# Altium schematic sheet 36.SchDoc
size 513 x 386 mm
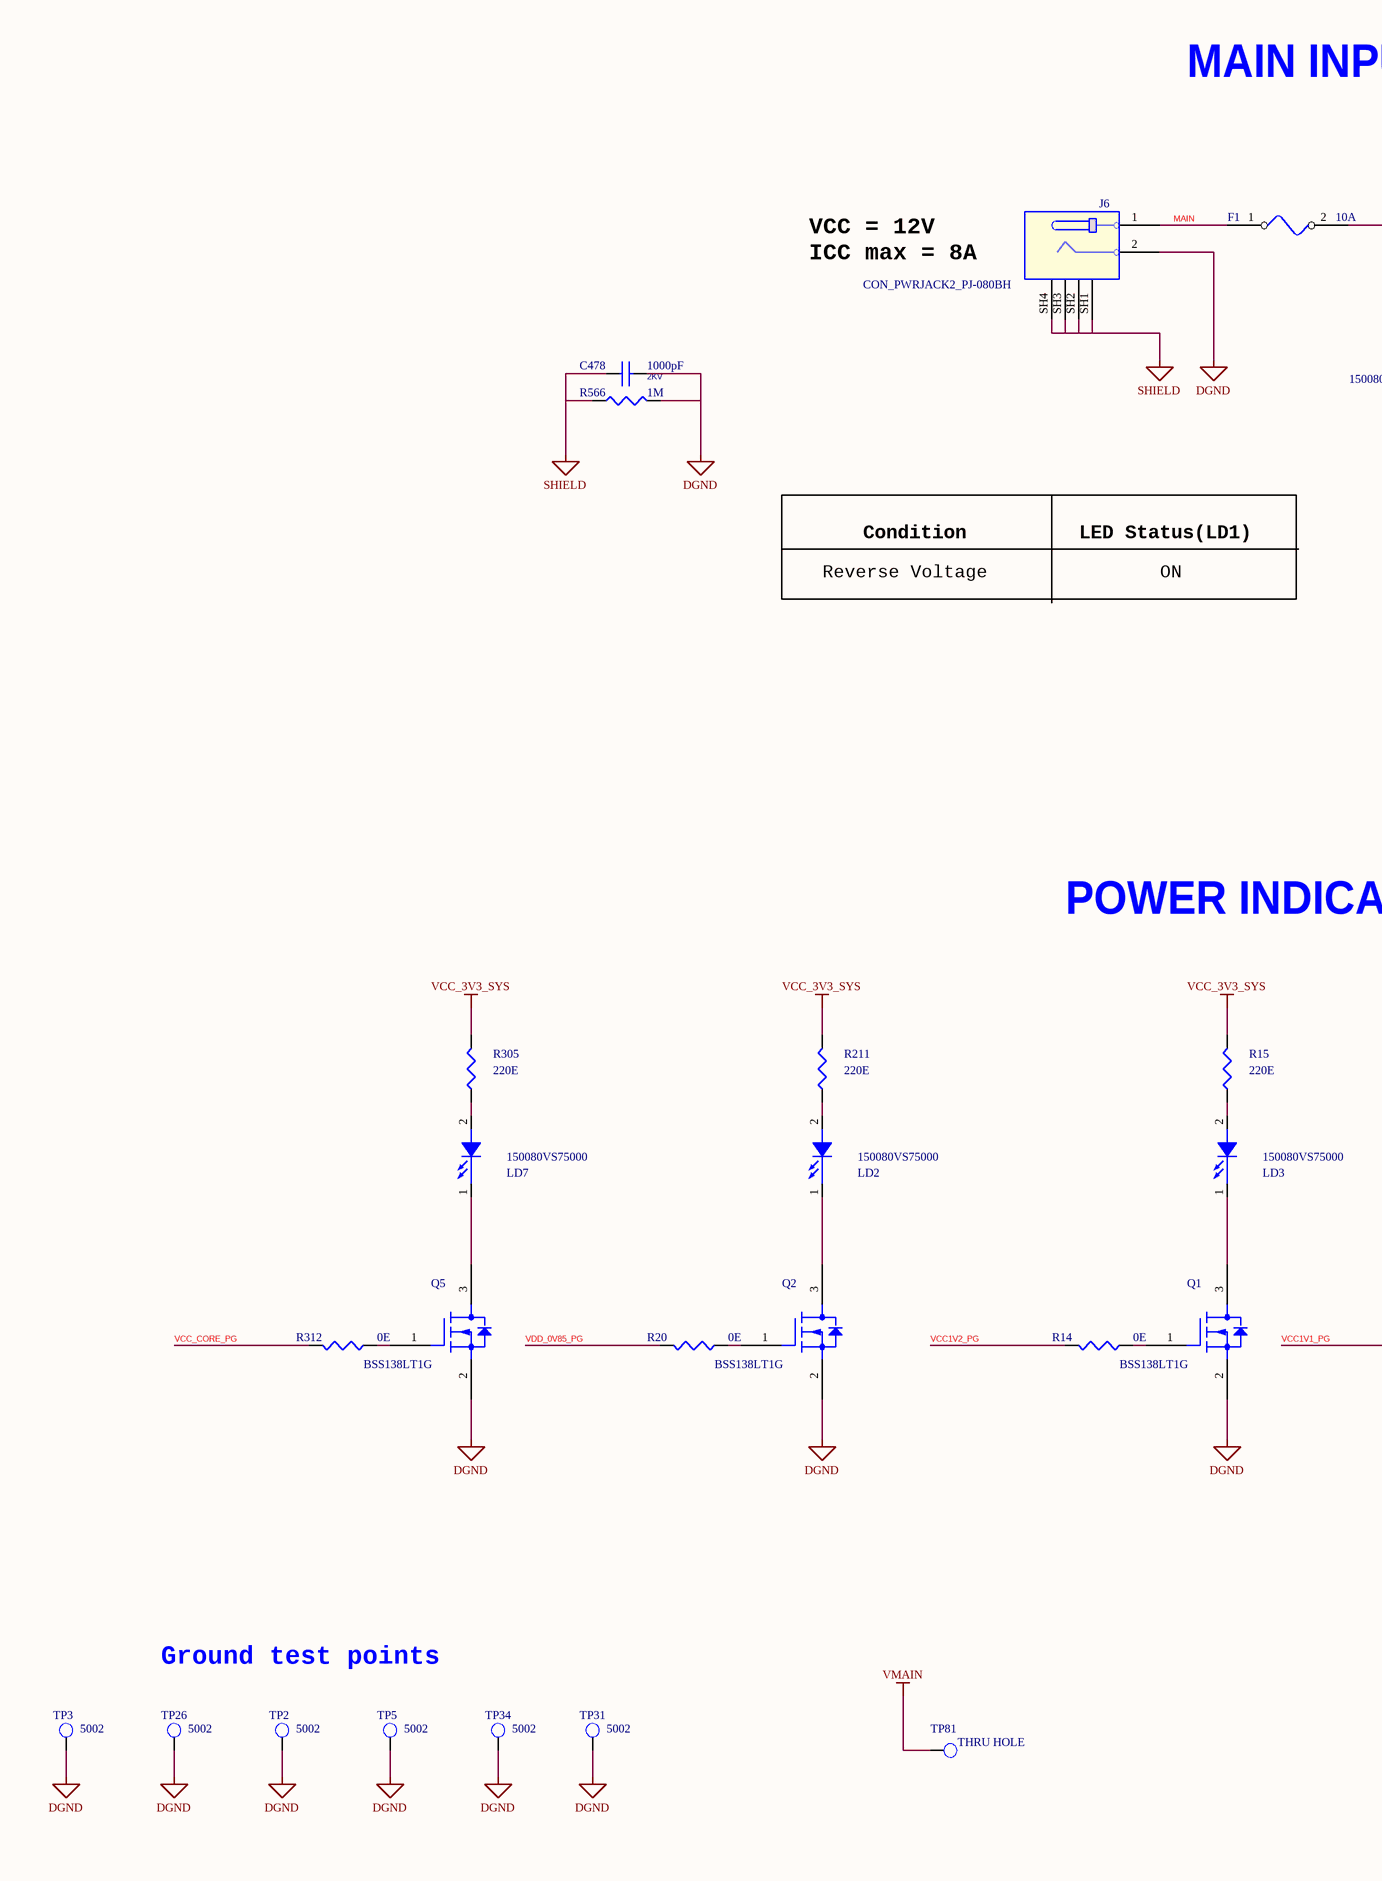
[diagram p0: 36.SchDoc, left]
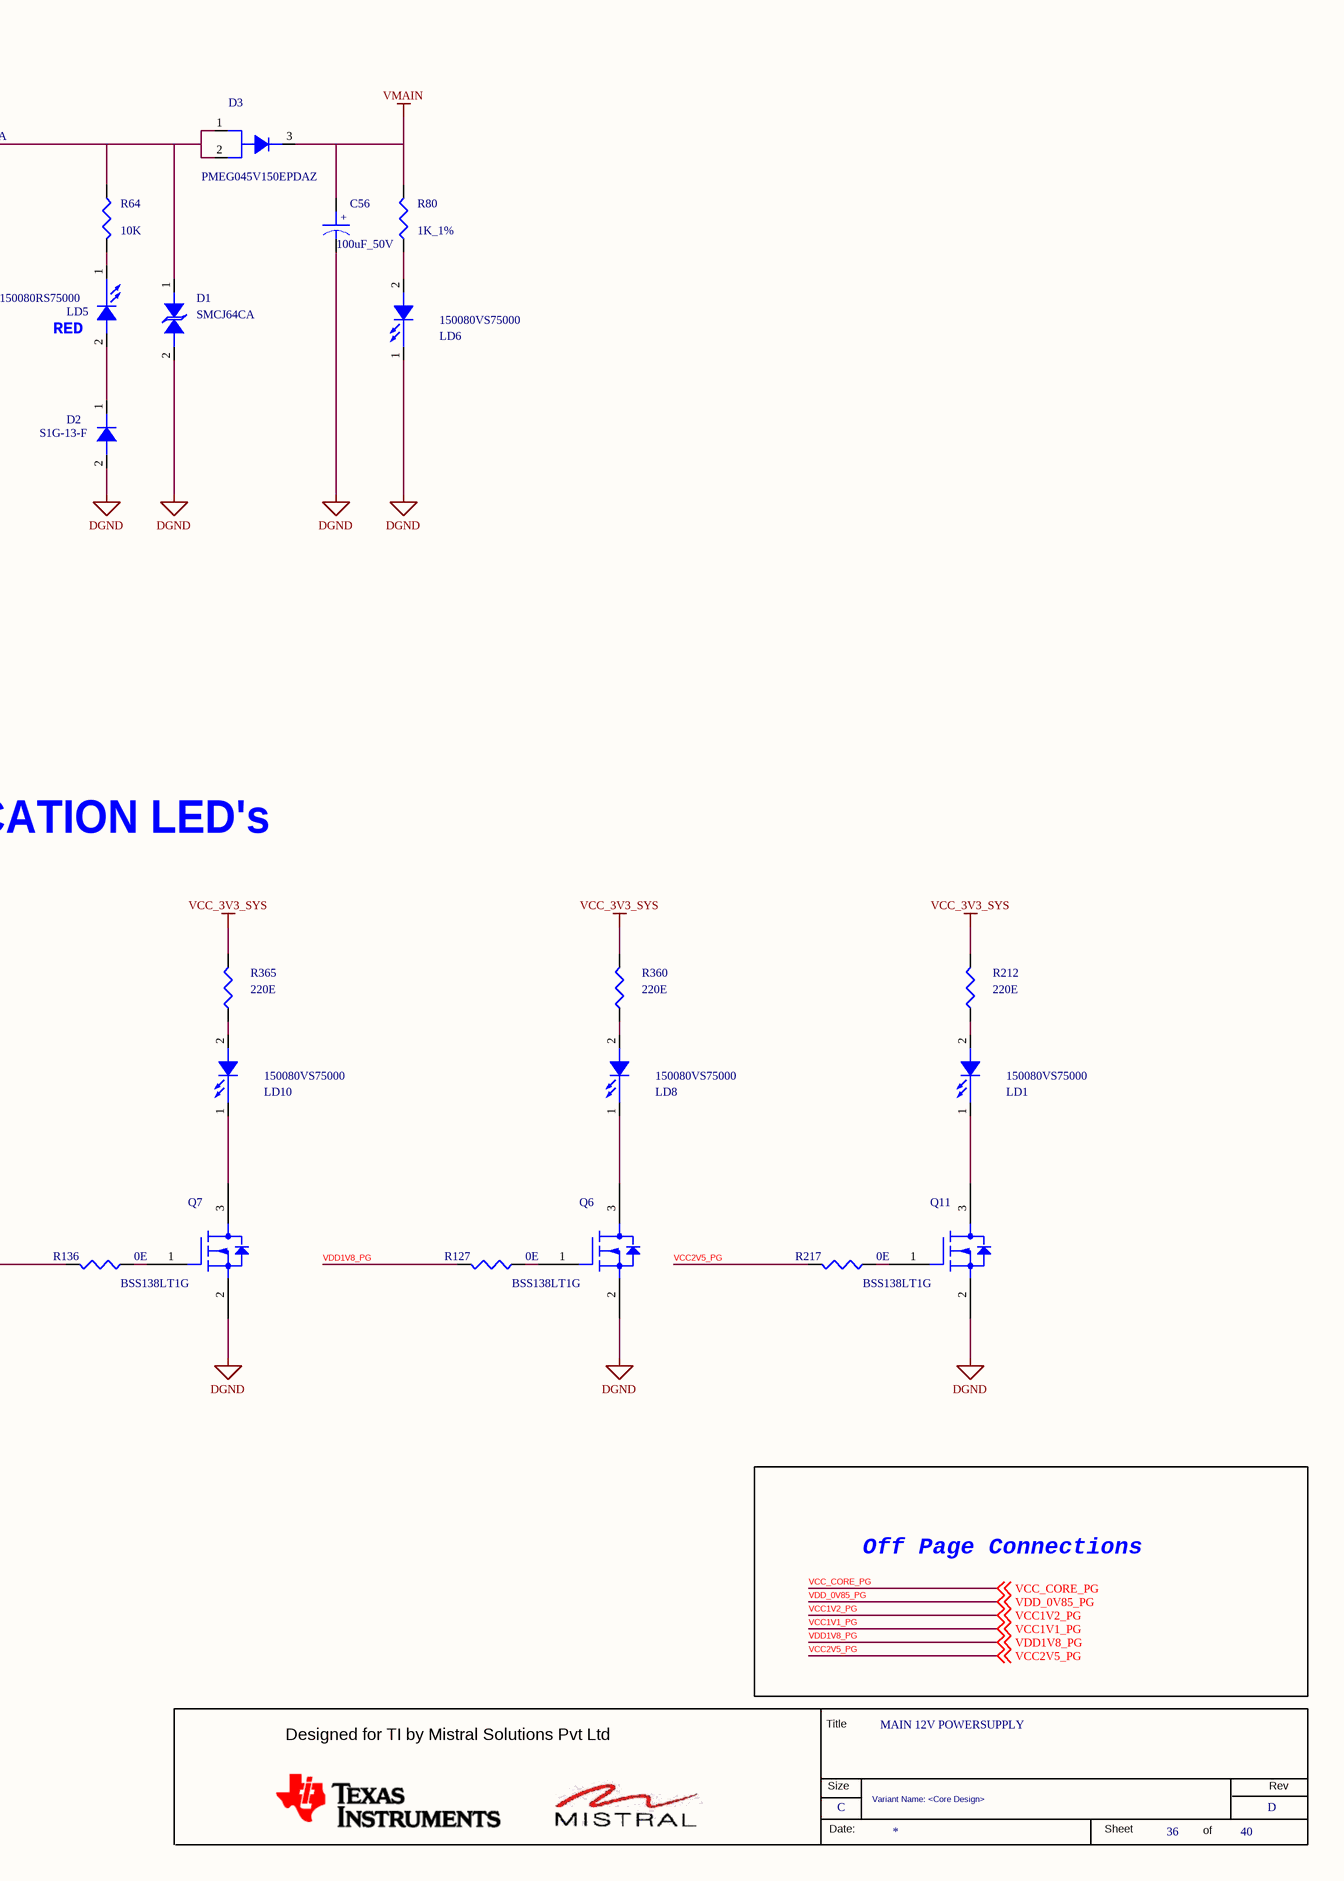
[diagram p1: 36.SchDoc, right]

## Parts
*  RevCode: D  Title: MAIN 12V POWERSUPPLY  Page Size: C  Page Number: 36  Page Count: 40  Variant Name: <Core Design>  (hidden comment: MISTRAL_TITLEBLK_CSIZE)  (graphical)
C56  100uF_50V  [CAPAE_D8CASE_8]
C478  1000pF  Voltage: 2KV  [CAP1206_1-75]
D1  SMCJ64CA  [DIO_SMC]
D2  S1G-13-F  [DIO_SMA]
D3  PMEG045V150EPDAZ  [CFP15_PMEG045V150EPD_0-9]
F1  10A  [FUSE_397_410X110_SMD_2-9]
J6  CON_PWRJACK2_PJ-080BH  [CON_PWRJACK2_PJ-080BH_P_R_T_13-4]
LD1  150080VS75000  [LED_150080VS75000_80X50_SMD_0-8]
LD2  150080VS75000  [LED_150080VS75000_80X50_SMD_0-8]
LD3  150080VS75000  [LED_150080VS75000_80X50_SMD_0-8]
LD5  150080RS75000  [LED_150080VS75000_80X50_SMD_0-8]
LD6  150080VS75000  [LED_150080VS75000_80X50_SMD_0-8]
LD7  150080VS75000  [LED_150080VS75000_80X50_SMD_0-8]
LD8  150080VS75000  [LED_150080VS75000_80X50_SMD_0-8]
LD10  150080VS75000  [LED_150080VS75000_80X50_SMD_0-8]
Q1  BSS138LT1G  [SOT23-123_1-2]
Q2  BSS138LT1G  [SOT23-123_1-2]
Q5  BSS138LT1G  [SOT23-123_1-2]
Q6  BSS138LT1G  [SOT23-123_1-2]
Q7  BSS138LT1G  [SOT23-123_1-2]
Q11  BSS138LT1G  [SOT23-123_1-2]
R14  0E  [RES0402_0-5]
R15  220E  [RES0402_0-5]
R20  0E  [RES0402_0-5]
R64  10K  [RES1206_0-75]
R80  1K_1%  [RES0402_0-5]
R127  0E  [RES0402_0-5]
R136  0E  [RES0402_0-5]
R211  220E  [RES0402_0-5]
R212  220E  [RES0402_0-5]
R217  0E  [RES0402_0-5]
R305  220E  [RES0402_0-5]
R312  0E  [RES0402_0-5]
R360  220E  [RES0402_0-5]
R365  220E  [RES0402_0-5]
R566  1M  [RES0603_0-75]
TP2  5002  [TP_CIR67D40_TH_4-6]
TP3  5002  [TP_CIR67D40_TH_4-6]
TP5  5002  [TP_CIR67D40_TH_4-6]
TP26  5002  [TP_CIR67D40_TH_4-6]
TP31  5002  [TP_CIR67D40_TH_4-6]
TP34  5002  [TP_CIR67D40_TH_4-6]
TP81  THRU HOLE  [TP_40X65]

## Nets
DGND: C56.2 C478.2 D1.2(ANODE) D2.2(A) J6.2 LD6.1(CATHODE) Q1.2(S) Q2.2(S) Q5.2(S) Q6.2(S) Q7.2(S) Q11.2(S) R566.2 TP2.1(TP) TP3.1(TP) TP5.1(TP) TP26.1(TP) TP31.1(TP) TP34.1(TP)
SHIELD: C478.1 J6.SH1 J6.SH2 J6.SH3 J6.SH4 R566.1
VCC_3V3_SYS: R15.2 R211.2 R212.2 R305.2 R360.2 R365.2
VMAIN: C56.1 D3.3(K) R80.2 TP81.1(TP)
MAIN: F1.1 J6.1
VCC1V1_PG: R136.2 ; off-sheet VCC1V1_PG
VCC1V2_PG: R14.2 ; off-sheet VCC1V2_PG
VCC2V5_PG: R217.2 ; off-sheet VCC2V5_PG
VCC_CORE_PG: R312.2 ; off-sheet VCC_CORE_PG
VDD1V8_PG: R127.2 ; off-sheet VDD1V8_PG
VDD_0V85_PG: R20.2 ; off-sheet VDD_0V85_PG
NetD1_1: D1.1(CATHODE) D3.1(A1) D3.2(A2) F1.2 R64.1
NetD2_1: D2.1(K) LD5.2(ANODE)
NetLD1_1: LD1.1(CATHODE) Q11.3(D)
NetLD1_2: LD1.2(ANODE) R212.1
NetLD2_1: LD2.1(CATHODE) Q2.3(D)
NetLD2_2: LD2.2(ANODE) R211.1
NetLD3_1: LD3.1(CATHODE) Q1.3(D)
NetLD3_2: LD3.2(ANODE) R15.1
NetLD5_1: LD5.1(CATHODE) R64.2
NetLD6_2: LD6.2(ANODE) R80.1
NetLD7_1: LD7.1(CATHODE) Q5.3(D)
NetLD7_2: LD7.2(ANODE) R305.1
NetLD8_1: LD8.1(CATHODE) Q6.3(D)
NetLD8_2: LD8.2(ANODE) R360.1
NetLD10_1: LD10.1(CATHODE) Q7.3(D)
NetLD10_2: LD10.2(ANODE) R365.1
NetQ1_1: Q1.1(G) R14.1
NetQ2_1: Q2.1(G) R20.1
NetQ5_1: Q5.1(G) R312.1
NetQ6_1: Q6.1(G) R127.1
NetQ7_1: Q7.1(G) R136.1
NetQ11_1: Q11.1(G) R217.1

## Notes on the sheet
- MAIN INPUT 12V DC
- VCC = 12V
  ICC max = 8A
- (near LD5) RED
- Condition
- LED Status(LD1)
- Reverse Voltage
- ON
- POWER INDICATION LED's
- Ground test points
- Off Page Connections
- (in symbol CAP_POL_Dup1) +
- (in symbol MISTRAL_TITLEBLK_CSIZE) Title; Designed for TI by Mistral Solutions Pvt Ltd; Size; Rev; Date:; Sheet; of

## Library data of the parts
* = MISTRAL_TITLEBLK_CSIZE: Issue: 1.0; Page Create Date: March  8, 1995; Page Modify Date: *
C56 = CAP_POL_Dup1: CAP ELECTROLYTIC 100uF 50V 20% D8CASE_6666; Part_type: CAPACITORS\ELECTROLYTIC; Mfr_part_number: EEE-FTH101XAP; Mfr_name: PANASONIC-ECG; Mistral Part No: 120018100013-R; Custom_Duty: 15%; Customs_HS_Code: 85322990; Wattage: NA; Project: TI_J7_SVB-DUT; Footprint Path: Y:\MIS_DATABASE\Library\ALTIUM_TOOL\PCB_FOOTPRINTS\Altium_Footprint_Lib.PcbLib; Library Path: Y:\MIS_DATABASE\Library\ALTIUM_TOOL\SCHEMATICS_PARTS\MS_DISCRETE_Library.schlib; MECHANICAL 3D STEP FILE: CAPAE_D8CASE_8; Chkd/date: MANIRAJA/051018; Crtd /date: ALVY/051018; Datasheet: Y:\MIS_DATABASE\DATASHEETS\CAPACITORS\FTV-SER.PDF; Temperature: -55癈+105癈; Weight: 440mg; Height: 8.00MM; Footprint Ref: CAPAE_D8CASE_8; Library Ref: CAP_POL; Distributor_part_number: PCE5024CT-ND; Distributor_name: DIGIKEY; Package: D8CASE_6666; Voltage: 50V; Tolerance: 20%; PCB Footprint: CAPAE_D8CASE_8
C478 = CAP_Dup3: CAP CERAMIC 1000pF 2KV 10% X7R 1206; Mistral Part No: 120015080006-R; Mfr_name: AVX CORPORATION; Mfr_part_number: 1206GC102KAT1A; Part_type: CAPACITORS\CERAMIC; Project: ADR1B; Customs_HS_Code: 85322990; Custom_Duty: 15%; Wattage: NA; Tolerance: 10%; Package: 1206; Distributor_name: DIGIKEY; Distributor_part_number: 478-2956-1-ND; Height: 1.52MM; Weight: 16.2mg; Temperature: -55癈+125癈; Datasheet: Y:\MIS_DATABASE\DATASHEETS\CAPACITORS\AVX_HV-MLC.PDF; Crtd /date: MAZHAR/281106; Chkd/date: SHREESHAIL/291106; Library Ref: CAP; Footprint Ref: CAP1206_1-75; Library Path: Y:\MIS_DATABASE\Library\ALTIUM_TOOL\SCHEMATICS_PARTS\MS_DISCRETE_Library.schlib; Footprint Path: Y:\MIS_DATABASE\Library\ALTIUM_TOOL\PCB_FOOTPRINTS\Altium_Footprint_Lib.PcbLib; MECHANICAL 3D STEP FILE: CAP1206_1-75; PCB Footprint: CAP1206_1-75
D1 = DIODE_TVS_DUAL: DIODE TVS BI-DIE 1500W 64V SMC; Mistral Part No: 130015100009-R; Mfr_name: LITTLE FUSE; Part_type: DIODE\TVS; Project: GALILEO_EVM; Tolerance: NA; Customs_HS_Code: 85412900; Custom_Duty: 15%; Library Ref: DIODE_TVS_DUAL; Mfr_part_number: SMCJ64CA; Voltage: 64V; Wattage: NA; Package: SMC; Distributor_name: DIGIKEY; Distributor_part_number: SMCJ64CALFCT-ND; Height: 2.62MM; Weight: NA; Temperature: -55癈+150癈; Datasheet: Y:\MIS_DATABASE\DATASHEETS\DISCRETES\DIODES\LTFUSE-SMCJ.PDF; Crtd /date: VASANTHA/101015; Chkd/date: VASANTHA/101015; PCB Footprint: DIO_SMC
D2 = DIODE: DIODE RECTIFIER 400V 1A SMA; Mistral Part No: 130009030153; Mfr_name: DIODES INC; Part_type: DIODE\RECTIFIER; Project: CPB; Customs_HS_Code: 85412900; Custom_Duty: 15%; PCB Footprint: DIO_SMA; Library Ref: DIODE; Mfr_part_number: S1G-13-F; Voltage: 400V; Package: SMA; Distributor_name: DIGIKEY; Distributor_part_number: S1G-FDICT-ND; Height: 2.30MM; Weight: 0.0064g; Temperature: -65癈+150癈; Datasheet: Y:\MIS_DATABASE\DATASHEETS\DISCRETES\DIODES\S1.PDF; Crtd /date: USMAN/220808; Chkd/date: SUHAS/061010
D3 = DIODE_SCHOTTKY_POWERMITE-3: DIODE SCHOTTKY RECTIFIER 45V 15A CFP15 (SOT1289); Part_type: DIODE\SCHOTTKY; Mfr_name: NEXPERIA; Mistral Part No: 130020020003-R; Custom_Duty: 15%; Customs_HS_Code: 85412900; Wattage: NA; Project: TI_MAXIE_CPB; Footprint Path: Y:\MIS_DATABASE\Library\ALTIUM_TOOL\PCB_FOOTPRINTS\Altium_Footprint_Lib.PcbLib; Library Path: Y:\MIS_DATABASE\Library\ALTIUM_TOOL\SCHEMATICS_PARTS\MS_DISCRETE_Library.schlib; MECHANICAL 3D STEP FILE: CFP15_PMEG045V150EPD_0-9; Chkd/date: MANIRAJA/070220; Crtd /date: ALVY/070220; Datasheet: Y:\MIS_DATABASE\DATASHEETS\DISCRETES\DIODES\PMEG045V150EPD.PDF; Temperature: -55癈+175癈; Weight: 87.3mg; Height: 0.82MM; Library Ref: DIODE_SCHOTTKY_POWERMITE-3; Distributor_part_number: 1727-1905-1-ND; Distributor_name: DIGIKEY; Package: CFP15; Voltage: NA; Tolerance: NA; Mfr_part_number: PMEG045V150EPDAZ; Footprint Ref: CFP15_PMEG045V150EPD_0-9; PCB Footprint: CFP15_PMEG045V150EPD_0-9
F1 = FUSE: FUSE 10A 60V FAST SMD; Mistral Part No: 130009030821-R; Mfr_name: COOPER BUSSMANN; Mfr_part_number: 1025FA10-R; Project: SMART VIEW_NVR; PCB Footprint: FUSE_397_410X110_SMD_2-9; Library Ref: FUSE; Part_type: FUSE; Voltage: 60V; Package: SMD; Distributor_name: DIGIKEY; Distributor_part_number: TR2/1025FA10-R-ND; Height: 2.90MM; Datasheet: Y:\MIS_DATABASE\DATASHEETS\MISC\FUSE\1025FA-SER.PDF; Crtd /date: MAZHAR/220907; Chkd/date: RAGESH/151010
J6 = CON_PWRJACK2_PJ-082BH: CON POWER JACK 2POS MALE RT TH; Mistral Part No: 150021020035-R; Mfr_name: CUI INC; Part_type: CONNECTOR\JACK; Project: TI_AM64x_EVM; Tolerance: NA; Customs_HS_Code: 85369090; Custom_Duty: 24%; Mfr_part_number: PJ-080BH; Voltage: NA; Wattage: NA; Package: THRU-HOLE; Distributor_name: DIGIKEY; Distributor_part_number: CP-080BHCT-ND; Library Ref: CON_PWRJACK2_PJ-082BH; Footprint Ref: CON_PWRJACK2_PJ-080BH_P_R_T_13-4; Height: 13.40MM; Weight: 9090mg; Temperature: -25癈+85癈; Datasheet: Y:\MIS_DATABASE\DATASHEETS\CONNECTORS\PJ-080BH.PDF; Crtd /date: MANIRAJA/100221; Chkd/date: ALVY/100221; MECHANICAL 3D STEP FILE: CON_PWRJACK2_PJ-080BH_P_R_T_13-4; Library Path: Y:\MIS_DATABASE\Library\ALTIUM_TOOL\SCHEMATICS_PARTS\MS_CONNECTOR_Library.schlib; Footprint Path: Y:\MIS_DATABASE\Library\ALTIUM_TOOL\PCB_FOOTPRINTS\Altium_Footprint_Lib.PcbLib; PCB Footprint: CON_PWRJACK2_PJ-080BH_P_R_T_13-4
LD1-LD3 LD6-LD8 LD10 = DIODE_LED: DIODE LED BRIGHT GREEN SMD; Part_type: OPTO\LED; Mfr_name: WURTH ELECTRONICS; Mistral Part No: 130020080012-R; Custom_Duty: 24%; Customs_HS_Code: 85439000; Wattage: NA; Project: AM64x_EVM_BRD; Footprint Path: Y:\MIS_DATABASE\Library\ALTIUM_TOOL\PCB_FOOTPRINTS\Altium_Footprint_Lib.PcbLib; Library Path: Y:\MIS_DATABASE\Library\ALTIUM_TOOL\SCHEMATICS_PARTS\MS_OPTO_Library.schlib; MECHANICAL 3D STEP FILE: LED_150080VS75000_80X50_SMD_0-8; Chkd/date: MANIRAJA/180820; Crtd /date: ALVY/180820; Datasheet: Y:\MIS_DATABASE\DATASHEETS\DISCRETES\LEDS\150080VS75000.PDF; Temperature: -40癈+85癈; Weight: 10mg; Height: 0.80MM; Library Ref: DIODE_LED; Distributor_part_number: 732-4986-1-ND; Distributor_name: DIGIKEY; Package: SMD; Voltage: NA; Tolerance: NA; Mfr_part_number: 150080VS75000; Footprint Ref: LED_150080VS75000_80X50_SMD_0-8; PCB Footprint: LED_150080VS75000_80X50_SMD_0-8
LD5 = DIODE_LED: DIODE LED RED SMD; Part_type: OPTO\LED; Mfr_name: WURTH ELECTRONICS; Mistral Part No: 130020080013-R; Custom_Duty: 24%; Customs_HS_Code: 85439000; Wattage: NA; Project: AM64x_EVM_BRD; Footprint Path: Y:\MIS_DATABASE\Library\ALTIUM_TOOL\PCB_FOOTPRINTS\Altium_Footprint_Lib.PcbLib; Library Path: Y:\MIS_DATABASE\Library\ALTIUM_TOOL\SCHEMATICS_PARTS\MS_OPTO_Library.schlib; MECHANICAL 3D STEP FILE: LED_150080VS75000_80X50_SMD_0-8; Chkd/date: MANIRAJA/180820; Crtd /date: ALVY/180820; Datasheet: Y:\MIS_DATABASE\DATASHEETS\DISCRETES\LEDS\150080RS75000.PDF; Temperature: -40癈+85癈; Weight: 25mg; Height: 0.80MM; Library Ref: DIODE_LED; Distributor_part_number: 732-4984-1-ND; Distributor_name: DIGIKEY; Package: SMD; Voltage: NA; Tolerance: NA; Mfr_part_number: 150080RS75000; Footprint Ref: LED_150080VS75000_80X50_SMD_0-8; PCB Footprint: LED_150080VS75000_80X50_SMD_0-8
Q1 Q2 Q5-Q7 Q11 = MOSFET_BSS138LT1G: IC MOSFET N-CHANNEL 50V 200mA SOT23-3; Mistral Part No: 142016040001-R; Mfr_name: ON SEMICONDUCTOR; Part_type: ICS\POWER\MOSFET; Project: LRDE_ABCM; Tolerance: NA; Customs_HS_Code: 85423100; Custom_Duty: 15%; Footprint Path: Y:\MIS_DATABASE\Library\ALTIUM_TOOL\PCB_FOOTPRINTS\Altium_Footprint_Lib.PcbLib; Library Path: Y:\MIS_DATABASE\Library\ALTIUM_TOOL\SCHEMATICS_PARTS\MS_MOSFET_Library.schlib; MECHANICAL 3D STEP FILE: SOT23-123_1-2; PCB Footprint: SOT23-123_1-2; Footprint Ref: SOT23-123_1-2; Library Ref: MOSFET_BSS138W; Mfr_part_number: BSS138LT1G; Voltage: NA; Wattage: NA; Package: SOT23-3; Distributor_name: DIGIKEY; Distributor_part_number: BSS138LT1GOSCT-ND; Height: 1.11MM; Weight: 8mg; Temperature: -55癈+150癈; Datasheet: Y:\MIS_DATABASE\DATASHEETS\DISCRETES\TRANSISTORS_FETS\BSS138LT1G.PDF; Crtd /date: JEBRAN/060416; Chkd/date: MANIRAJA/250219
R14 R20 R127 R136 R217 R312 = RESISTOR_Dup5: RES 0E 1/16W JUMPER 0402; Part_type: RESISTORS\FIXED; Mfr_part_number: CRCW04020000Z0ED; Mfr_name: VISHAY; Mistral Part No: 110010080019-R; Custom_Duty: 15%; Customs_HS_Code: 85332119; Voltage: NA; Project: PB_BUGBASE; PCB Footprint: RES0402_0-5; MECHANICAL 3D STEP FILE: RES0402_0-5; Chkd/date: VASANTHA/201216; Crtd /date: MUDDU/190810; Datasheet: Y:\MIS_DATABASE\DATASHEETS\RESISTORS\CRCW0603.PDF; Temperature: -55癈+155癈; Weight: 0.65mg; Height: 0.40MM; Distributor_part_number: 541-0.0JCT-ND; Distributor_name: DIGIKEY; Package: 0402; Wattage: 1/16W; Tolerance: NA; Library Ref: RESISTOR; Footprint Ref: RES0402_0-5; Library Path: Y:\MIS_DATABASE\Library\ALTIUM_TOOL\SCHEMATICS_PARTS\MS_DISCRETE_Library.schlib; Footprint Path: Y:\MIS_DATABASE\Library\ALTIUM_TOOL\PCB_FOOTPRINTS\Altium_Footprint_Lib.PcbLib
R15 R211 R212 R305 R360 R365 = RESISTOR_Dup6: RES 220E 1/10W 5% 0402; Mistral Part No: 110009030506-R; Mfr_name: PANASONIC-ECG; Mfr_part_number: ERJ-2GEJ221X; Part_type: RESISTORS\FIXED; Voltage: NA; Project: RED EYE; Customs_HS_Code: 85332119; Custom_Duty: 15%; Footprint Ref: RES0402_0-5; PCB Footprint: RES0402_0-5; Footprint Path: Y:\MIS_DATABASE\Library\ALTIUM_TOOL\PCB_FOOTPRINTS\Altium_Footprint_Lib.PcbLib; Library Path: Y:\MIS_DATABASE\Library\ALTIUM_TOOL\SCHEMATICS_PARTS\MS_DISCRETE_Library.schlib; MECHANICAL 3D STEP FILE: RES0402_0-5; Temperature: -55癈+155癈; Weight: 0.8mg; Library Ref: RESISTOR; Tolerance: 5%; Wattage: 1/10W; Package: 0402; Distributor_name: DIGIKEY; Distributor_part_number: P220JCT-ND; Height: 0.40MM; Datasheet: Y:\MIS_DATABASE\DATASHEETS\RESISTORS\PAN-ERJSER_NOV17.PDF; Crtd /date: GEETHA/260406; Chkd/date: VASANTHA/291216
R64 = RESISTOR_Dup1: RES 10K 2/3W 5% 1206; Mistral Part No: 110015090016-R; Mfr_name: PANASONIC-ECG; Mfr_part_number: ERJ-P08J103V; Part_type: RESISTORS\FIXED; Project: GALILEO_EVM; Voltage: NA; Customs_HS_Code: 85332119; Custom_Duty: 15%; Tolerance: 5%; Wattage: 2/3W; Package: 1206; Distributor_name: DIGIKEY; Distributor_part_number: P10KALCT-ND; Height: 0.70MM; Weight: 10mg; Temperature: -55癈+155癈; Datasheet: Y:\MIS_DATABASE\DATASHEETS\RESISTORS\ERJ-PA_P0-SER.PDF; Crtd /date: VASANTHA/101015; Chkd/date: VASANTHA/101015; Library Ref: RESISTOR; Footprint Ref: RES1206_0-75; MECHANICAL 3D STEP FILE: RES1206_0-75; Library Path: Y:\MIS_DATABASE\Library\ALTIUM_TOOL\SCHEMATICS_PARTS\MS_DISCRETE_Library.schlib; Footprint Path: Y:\MIS_DATABASE\Library\ALTIUM_TOOL\PCB_FOOTPRINTS\Altium_Footprint_Lib.PcbLib; PCB Footprint: RES1206_0-75
R80 = RESISTOR_Dup5: RES 1K 1/10W 1% 0402; Mistral Part No: 110009030411-R; Mfr_name: PANASONIC-ECG; Mfr_part_number: ERJ-2RKF1001X; Part_type: RESISTORS\FIXED; Project: VOCERA; Voltage: NA; Customs_HS_Code: 85332119; Custom_Duty: 15%; Footprint Path: Y:\MIS_DATABASE\Library\ALTIUM_TOOL\PCB_FOOTPRINTS\Altium_Footprint_Lib.PcbLib; Library Path: Y:\MIS_DATABASE\Library\ALTIUM_TOOL\SCHEMATICS_PARTS\MS_DISCRETE_Library.schlib; MECHANICAL 3D STEP FILE: RES0402_0-5; Footprint Ref: RES0402_0-5; Library Ref: RESISTOR; Tolerance: 1%; Wattage: 1/10W; Package: 0402; Distributor_name: DIGIKEY; Distributor_part_number: P1.00KLCT-ND; Height: 0.40MM; Weight: 0.8mg; Temperature: -55癈+155癈; Datasheet: Y:\MIS_DATABASE\DATASHEETS\RESISTORS\PAN-ERJSER_NOV17.PDF; Crtd /date: MAZHAR/150506; Chkd/date: VASANTHA/281216; PCB Footprint: RES0402_0-5
R566 = RESISTOR_Dup6: RES 1M 1/10W 5% 0603; Part_type: RESISTORS\FIXED; Mfr_part_number: ERJ-3GEYJ105V; Mfr_name: PANASONIC-ECG; Mistral Part No: 110009030413-R; Custom_Duty: 15%; Customs_HS_Code: 85332119; Voltage: NA; Project: BSN; MECHANICAL 3D STEP FILE: RES0603_0-75; Chkd/date: VASANTHA/060217; Crtd /date: USMAN/111207; Datasheet: Y:\MIS_DATABASE\DATASHEETS\RESISTORS\PAN-ERJSER_NOV17.PDF; Temperature: -55癈+155癈; Weight: 2mg; Height: 0.55MM; Distributor_part_number: P1.0MGCT-ND; Distributor_name: DIGIKEY; Package: 0603; Wattage: 1/10W; Tolerance: 5%; Library Ref: RESISTOR; Footprint Ref: RES0603_0-75; Library Path: Y:\MIS_DATABASE\Library\ALTIUM_TOOL\SCHEMATICS_PARTS\MS_DISCRETE_Library.schlib; Footprint Path: Y:\MIS_DATABASE\Library\ALTIUM_TOOL\PCB_FOOTPRINTS\Altium_Footprint_Lib.PcbLib; PCB Footprint: RES0603_0-75
TP2 TP3 TP5 TP26 TP31 = TESTPOINT: ACCESSORIE PC TEST POINT; Mistral Part No: 160016120008-R; Mfr_name: KEYSTONE; Part_type: ACCESSORIES; Custom_Duty: NA; Project: EPOS_EVM; Footprint Path: Y:\MIS_DATABASE\Library\ALTIUM_TOOL\PCB_FOOTPRINTS\Altium_Footprint_Lib.PcbLib; Library Path: Y:\MIS_DATABASE\Library\ALTIUM_TOOL\SCHEMATICS_PARTS\MS_DISCRETE_Library.schlib; Customs_HS_Code: NA; Footprint Ref: TP_CIR67D40_TH_4-6; Mfr_part_number: 5002; Tolerance: NA; Voltage: NA; Wattage: NA; Package: NA; Distributor_name: DIGIKEY; Distributor_part_number: 36-5002-ND; Library Ref: TESTPOINT; Height: 4.57MM; Weight: NA; Temperature: NA; Datasheet: Y:\MIS_DATABASE\DATASHEETS\MISC\ACCESSORIES\5002.PDF; Crtd /date: MANIRAJA/121216; Chkd/date: VASANTHA/121216; MECHANICAL 3D STEP FILE: TP_CIR67D40_TH_4-6; PCB Footprint: TP_CIR67D40_TH_4-6
TP34 = TESTPOINT: ACCESSORIE PC TEST POINT; Part_type: ACCESSORIES; Mfr_name: KEYSTONE; Mistral Part No: 160016120008-R; Custom_Duty: NA; Project: EPOS_EVM; Footprint Path: Y:\MIS_DATABASE\Library\ALTIUM_TOOL\PCB_FOOTPRINTS\Altium_Footprint_Lib.PcbLib; Library Path: Y:\MIS_DATABASE\Library\ALTIUM_TOOL\SCHEMATICS_PARTS\MS_DISCRETE_Library.schlib; Customs_HS_Code: NA; Footprint Ref: TP_CIR67D40_TH_4-6; MECHANICAL 3D STEP FILE: TP_CIR67D40_TH_4-6; Chkd/date: VASANTHA/121216; Crtd /date: MANIRAJA/121216; Datasheet: Y:\MIS_DATABASE\DATASHEETS\MISC\ACCESSORIES\5002.PDF; Temperature: NA; Weight: NA; Height: 4.57MM; Library Ref: TESTPOINT; Distributor_part_number: 36-5002-ND; Distributor_name: DIGIKEY; Package: NA; Wattage: NA; Voltage: NA; Tolerance: NA; Mfr_part_number: 5002; PCB Footprint: TP_CIR67D40_TH_4-6
TP81 = TESTPOINT: TESTPOINT 1.0MM DRILL PTH; Mfr_name: LOCAL; Mistral Part No: 130009030938; Project: HSE; Library Ref: TESTPOINT; Chkd/date: MAZHAR/271211; Crtd /date: SHREESHAIL/041005; Datasheet: NA; Height: NA; Distributor_part_number: NA; Distributor_name: NA; Package: THRU-HOLE; Part_type: TESTPOINT; Mfr_part_number: TP_40X65; PCB Footprint: TP_40X65